# EAGLE design v8_8_controler (EAGLE 9.6.2)
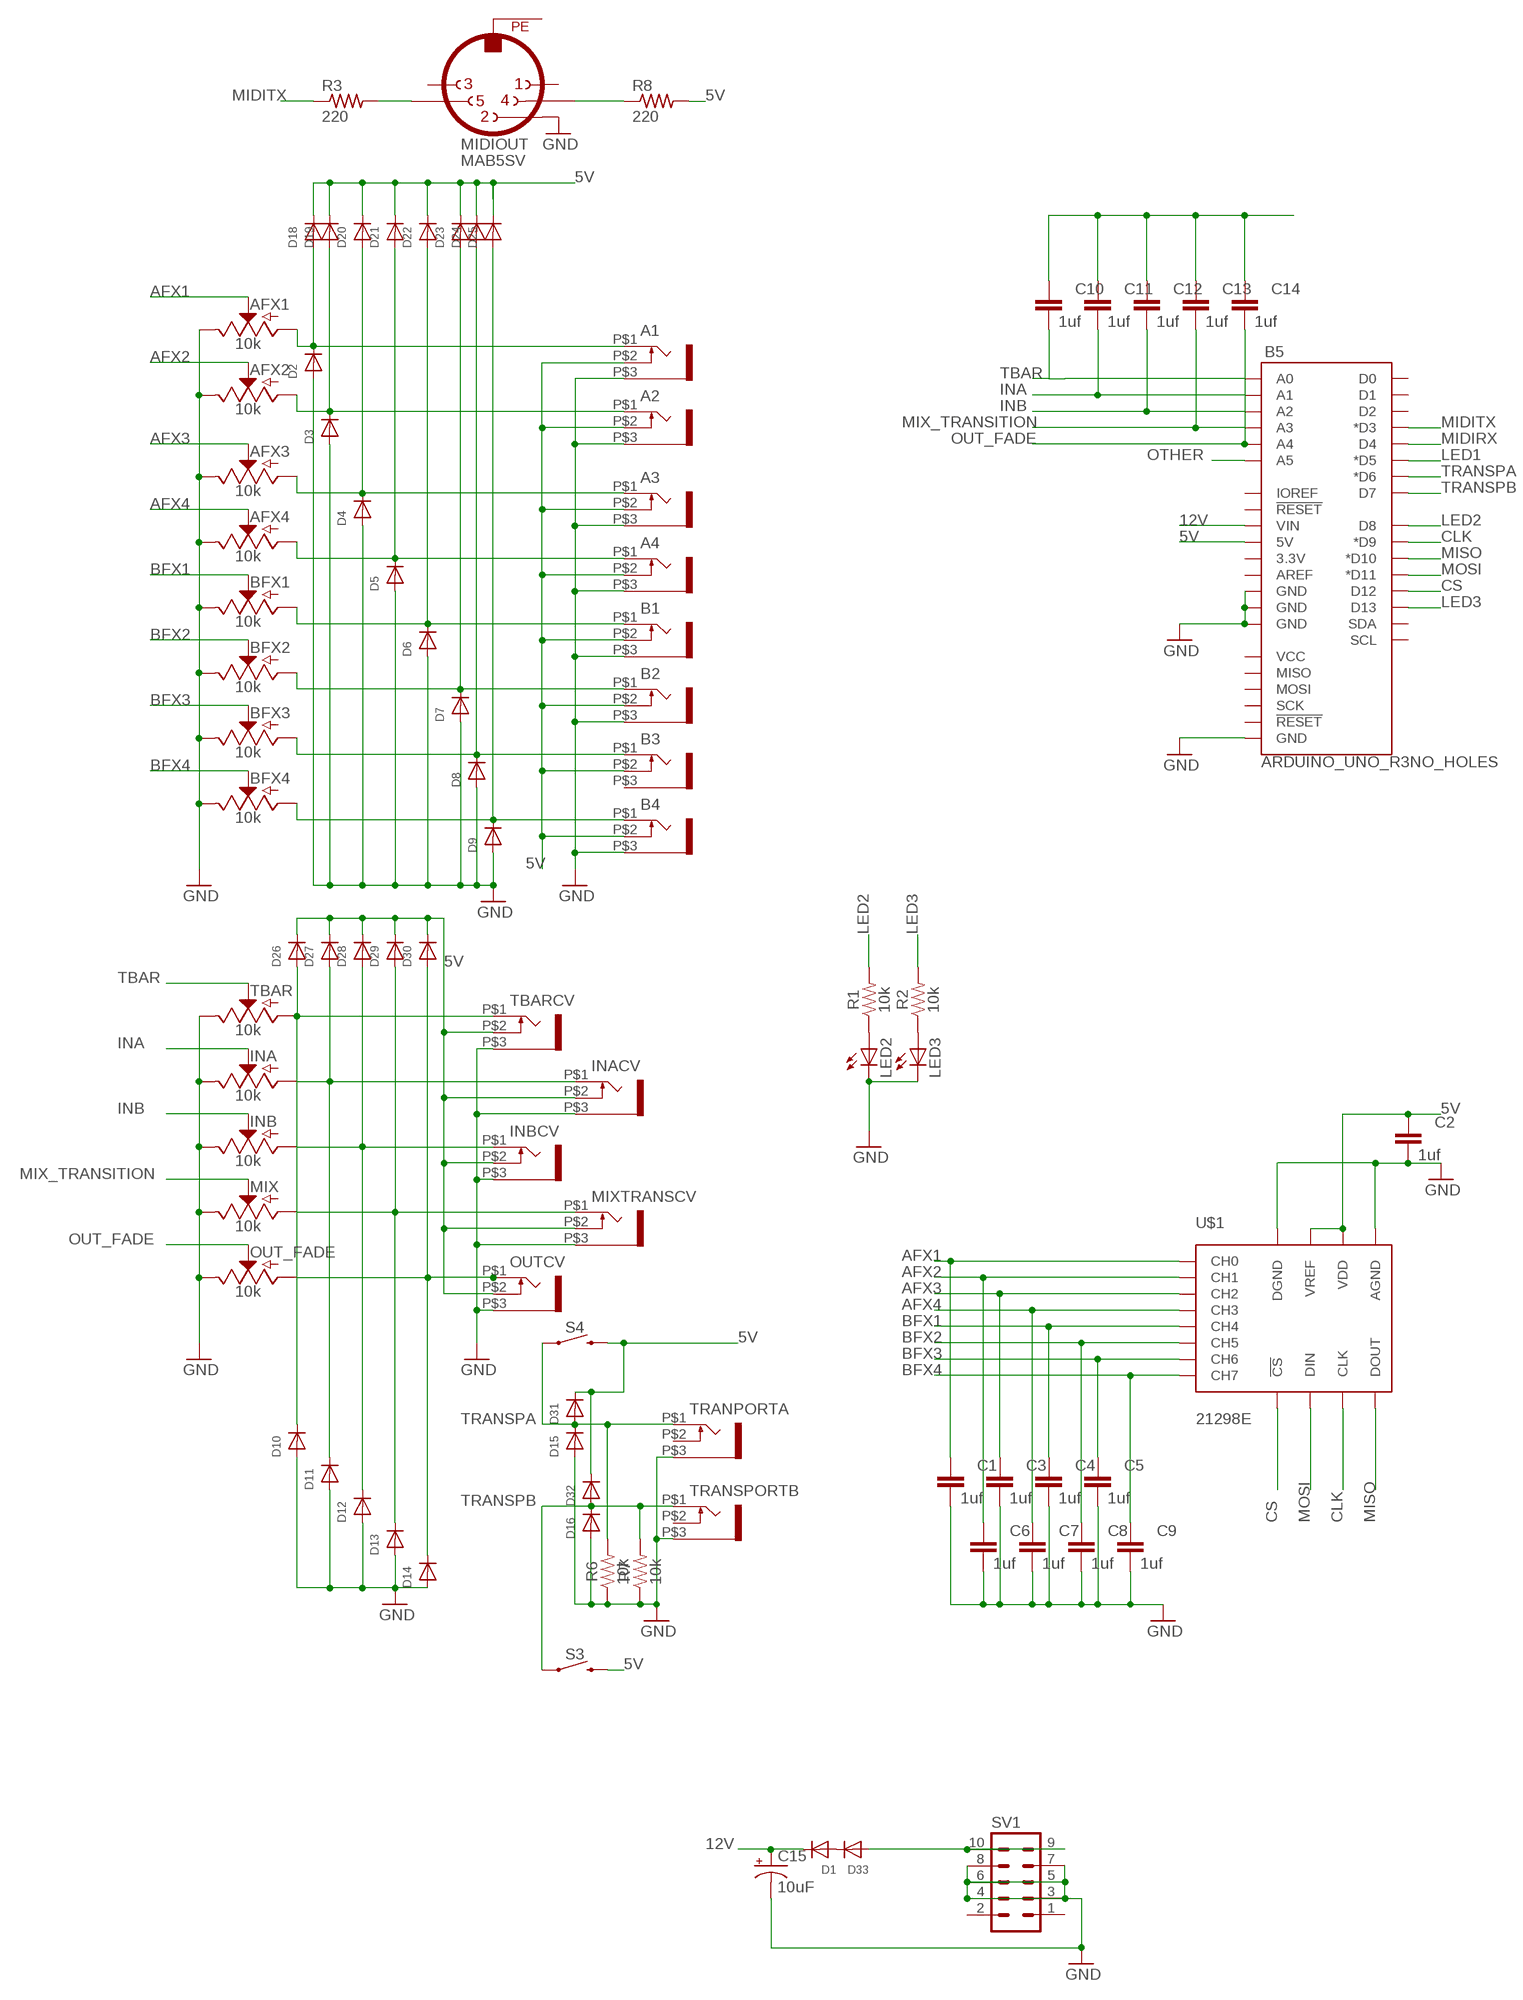
[diagram p0: schematic, sheet 1]

## Parts
A1  WQP-PJ301M-12_JACK  [WQP-PJ301M-12_JACK]
A2  WQP-PJ301M-12_JACK  [WQP-PJ301M-12_JACK]
A3  WQP-PJ301M-12_JACK  [WQP-PJ301M-12_JACK]
A4  WQP-PJ301M-12_JACK  [WQP-PJ301M-12_JACK]
AFX1  10k  POTENTIOMETER-PTH-9MM-1/20W-20%  [POT-PTH-ALPS]
AFX2  10k  POTENTIOMETER-PTH-9MM-1/20W-20%  [POT-PTH-ALPS]
AFX3  10k  POTENTIOMETER-PTH-9MM-1/20W-20%  [POT-PTH-ALPS]
AFX4  10k  POTENTIOMETER-PTH-9MM-1/20W-20%  [POT-PTH-ALPS]
B1  WQP-PJ301M-12_JACK  [WQP-PJ301M-12_JACK]
B2  WQP-PJ301M-12_JACK  [WQP-PJ301M-12_JACK]
B3  WQP-PJ301M-12_JACK  [WQP-PJ301M-12_JACK]
B4  WQP-PJ301M-12_JACK  [WQP-PJ301M-12_JACK]
B5  ARDUINO_UNO_R3NO_HOLES  [ARDUINO_R3_NO_HOLES]
BFX1  10k  POTENTIOMETER-PTH-9MM-1/20W-20%  [POT-PTH-ALPS]
BFX2  10k  POTENTIOMETER-PTH-9MM-1/20W-20%  [POT-PTH-ALPS]
BFX3  10k  POTENTIOMETER-PTH-9MM-1/20W-20%  [POT-PTH-ALPS]
BFX4  10k  POTENTIOMETER-PTH-9MM-1/20W-20%  [POT-PTH-ALPS]
C1  1uf  0.33UF/330NF-0805-50V-10%  [0805]
C2  1uf  0.33UF/330NF-0805-50V-10%  [0805]
C3  1uf  0.33UF/330NF-0805-50V-10%  [0805]
C4  1uf  0.33UF/330NF-0805-50V-10%  [0805]
C5  1uf  0.33UF/330NF-0805-50V-10%  [0805]
C6  1uf  0.33UF/330NF-0805-50V-10%  [0805]
C7  1uf  0.33UF/330NF-0805-50V-10%  [0805]
C8  1uf  0.33UF/330NF-0805-50V-10%  [0805]
C9  1uf  0.33UF/330NF-0805-50V-10%  [0805]
C10  1uf  0.33UF/330NF-0805-50V-10%  [0805]
C11  1uf  0.33UF/330NF-0805-50V-10%  [0805]
C12  1uf  0.33UF/330NF-0805-50V-10%  [0805]
C13  1uf  0.33UF/330NF-0805-50V-10%  [0805]
C14  1uf  0.33UF/330NF-0805-50V-10%  [0805]
C15  10uF  10UF-POLAR-EIA3528-20V-10%(TANT)  [EIA3528]
D1  DIODE_SOD-123FL  [SOD-123FL]
D2  DIODE_SOD-123FL  [SOD-123FL]
D3  DIODE_SOD-123FL  [SOD-123FL]
D4  DIODE_SOD-123FL  [SOD-123FL]
D5  DIODE_SOD-123FL  [SOD-123FL]
D6  DIODE_SOD-123FL  [SOD-123FL]
D7  DIODE_SOD-123FL  [SOD-123FL]
D8  DIODE_SOD-123FL  [SOD-123FL]
D9  DIODE_SOD-123FL  [SOD-123FL]
D10  DIODE_SOD-123FL  [SOD-123FL]
D11  DIODE_SOD-123FL  [SOD-123FL]
D12  DIODE_SOD-123FL  [SOD-123FL]
D13  DIODE_SOD-123FL  [SOD-123FL]
D14  DIODE_SOD-123FL  [SOD-123FL]
D15  DIODE_SOD-123FL  [SOD-123FL]
D16  DIODE_SOD-123FL  [SOD-123FL]
D18  DIODE_SOD-123FL  [SOD-123FL]
D19  DIODE_SOD-123FL  [SOD-123FL]
D20  DIODE_SOD-123FL  [SOD-123FL]
D21  DIODE_SOD-123FL  [SOD-123FL]
D22  DIODE_SOD-123FL  [SOD-123FL]
D23  DIODE_SOD-123FL  [SOD-123FL]
D24  DIODE_SOD-123FL  [SOD-123FL]
D25  DIODE_SOD-123FL  [SOD-123FL]
D26  DIODE_SOD-123FL  [SOD-123FL]
D27  DIODE_SOD-123FL  [SOD-123FL]
D28  DIODE_SOD-123FL  [SOD-123FL]
D29  DIODE_SOD-123FL  [SOD-123FL]
D30  DIODE_SOD-123FL  [SOD-123FL]
D31  DIODE_SOD-123FL  [SOD-123FL]
D32  DIODE_SOD-123FL  [SOD-123FL]
D33  DIODE_SOD-123FL  [SOD-123FL]
INA  10k  POTENTIOMETER-PTH-9MM-1/20W-20%  [POT-PTH-ALPS]
INACV  WQP-PJ301M-12_JACK  [WQP-PJ301M-12_JACK]
INB  10k  POTENTIOMETER-PTH-9MM-1/20W-20%  [POT-PTH-ALPS]
INBCV  WQP-PJ301M-12_JACK  [WQP-PJ301M-12_JACK]
LED2  LED3MM  [LED3MM]
LED3  LED3MM  [LED3MM]
MIDIOUT  MAB5SV  [MAB5SV]
MIX  10k  POTENTIOMETER-PTH-9MM-1/20W-20%  [POT-PTH-ALPS]
MIXTRANSCV  WQP-PJ301M-12_JACK  [WQP-PJ301M-12_JACK]
OUT_FADE  10k  POTENTIOMETER-PTH-9MM-1/20W-20%  [POT-PTH-ALPS]
OUTCV  WQP-PJ301M-12_JACK  [WQP-PJ301M-12_JACK]
R1  10k  0.75OHM-0805-1/4W-1%  [0805]
R2  10k  0.75OHM-0805-1/4W-1%  [0805]
R3  220  R-US_R0805  [R0805]
R6  10k  0.75OHM-0805-1/4W-1%  [0805]
R7  10k  0.75OHM-0805-1/4W-1%  [0805]
R8  220  R-US_R0805  [R0805]
S3  MOMENTARY-SWITCH-SPST-PTH-6.0MM  [TACTILE_SWITCH_PTH_6.0MM]
S4  MOMENTARY-SWITCH-SPST-PTH-6.0MM  [TACTILE_SWITCH_PTH_6.0MM]
SV1  MA05-2  [MA05-2]
TBAR  10k  POTENTIOMETER-PTH-9MM-1/20W-20%  [POT-PTH-ALPS]
TBARCV  WQP-PJ301M-12_JACK  [WQP-PJ301M-12_JACK]
TRANPORTA  WQP-PJ301M-12_JACK  [WQP-PJ301M-12_JACK]
TRANSPORTB  WQP-PJ301M-12_JACK  [WQP-PJ301M-12_JACK]
U$1  21298E  [PDIP16]

## Nets
5V: A1.P$2 A2.P$2 A3.P$2 A4.P$2 B1.P$2 B2.P$2 B3.P$2 B4.P$2 B5.5V C2.1 D18.C D19.C D20.C D21.C D22.C D23.C D24.C D25.C D26.C D27.C D28.C D29.C D30.C D31.C D32.C INACV.P$2 INBCV.P$2 MIXTRANSCV.P$2 OUTCV.P$2 R8.2 S3.3 S4.3 TBARCV.P$2 U$1.P$15(VREF) U$1.P$16(VDD)
12V: B5.VIN C15.A(+) D1.C
AFX1: AFX1.P$2(S) C1.1 U$1.P$1(CH0)
AFX2: AFX2.P$2(S) C6.1 U$1.P$2(CH1)
AFX3: AFX3.P$2(S) C3.1 U$1.P$3(CH2)
AFX4: AFX4.P$2(S) C7.1 U$1.P$4(CH3)
BFX1: BFX1.P$2(S) C4.1 U$1.P$5(CH4)
BFX2: BFX2.P$2(S) C8.1 U$1.P$6(CH5)
BFX3: BFX3.P$2(S) C5.1 U$1.P$7(CH6)
BFX4: BFX4.P$2(S) C9.1 U$1.P$8(CH7)
CLK: B5.D9(*D9) U$1.P$13(CLK)
CS: B5.D12 U$1.P$10(!CS)
GND: A1.P$3 A2.P$3 A3.P$3 A4.P$3 AFX1.P$1(E) AFX2.P$1(E) AFX3.P$1(E) AFX4.P$1(E) B1.P$3 B2.P$3 B4.P$3 B5.GND@1(GND) B5.GND@2(GND) B5.GND@3(GND) B5.GND@4(GND) BFX1.P$1(E) BFX2.P$1(E) BFX3.P$1(E) BFX4.P$1(E) C1.2 C2.2 C3.2 C4.2 C5.2 C6.2 C7.2 C8.2 C9.2 C15.C(-) D2.A D3.A D4.A D5.A D6.A D7.A D8.A D9.A D10.A D11.A D12.A D13.A D14.A D15.A D16.A INA.P$1(E) INACV.P$3 INB.P$1(E) INBCV.P$3 LED2.K(C) LED3.K(C) MIDIOUT.2 MIX.P$1(E) MIXTRANSCV.P$3 OUT_FADE.P$1(E) OUTCV.P$3 R6.1 R7.1 SV1.3 SV1.4 SV1.5 SV1.6 SV1.7 SV1.8 TBAR.P$1(E) TBARCV.P$3 TRANPORTA.P$3 TRANSPORTB.P$3 U$1.P$9(DGND) U$1.P$14(AGND)
INA: B5.A1 C11.2 INA.P$2(S)
INB: B5.A2 C12.2 INB.P$2(S)
LED1: B5.D5(*D5)
LED2: B5.D8 R1.2
LED3: B5.D13 R2.2
MIDIRX: B5.D4
MIDITX: B5.D3(*D3) R3.1
MISO: B5.D10(*D10) U$1.P$12(DOUT)
MIX_TRANSITION: B5.A3 C13.2 MIX.P$2(S)
MOSI: B5.D11(*D11) U$1.P$11(DIN)
N$1: A1.P$1 AFX1.P$3(A) D2.C D18.A
N$2: A2.P$1 AFX2.P$3(A) D3.C D19.A
N$3: A3.P$1 AFX3.P$3(A) D4.C D20.A
N$4: A4.P$1 AFX4.P$3(A) D5.C D21.A
N$5: B1.P$1 BFX1.P$3(A) D6.C D22.A
N$6: B2.P$1 BFX2.P$3(A) D7.C D23.A
N$7: B3.P$1 BFX3.P$3(A) D8.C D24.A
N$8: B4.P$1 BFX4.P$3(A) D9.C D25.A
N$9: MIDIOUT.4 R8.1
N$10: LED2.A R1.1
N$11: MIDIOUT.5 R3.2
N$12: LED3.A R2.1
N$13: D1.A D33.C
N$14: D10.C D26.A TBAR.P$3(A) TBARCV.P$1
N$15: D11.C D27.A INA.P$3(A) INACV.P$1
N$16: D12.C D28.A INB.P$3(A) INBCV.P$1
N$17: D13.C D29.A MIX.P$3(A) MIXTRANSCV.P$1
N$18: D14.C D30.A OUT_FADE.P$3(A) OUTCV.P$1
N$19: C10.1 C11.1 C12.1 C13.1 C14.1
N$20: D33.A SV1.9 SV1.10
OTHER: B5.A5
OUT_FADE: B5.A4 C14.2 OUT_FADE.P$2(S)
TBAR: B5.A0 C10.2 TBAR.P$2(S)
TRANSPA: B5.D6(*D6) D15.C D31.A R6.2 S4.1 TRANPORTA.P$1
TRANSPB: B5.D7 D16.C D32.A R7.2 S3.1 TRANSPORTB.P$1
Unconnected: B3.P$3 B5.3.3V B5.AREF B5.D0 B5.D1 B5.D2 B5.IOREF B5.MISO B5.MOSI B5.RESET@1(!RESET!) B5.RESET@2(!RESET!) B5.SCK B5.SCL B5.SDA B5.VCC MIDIOUT.1 MIDIOUT.3 SV1.1 SV1.2 TRANPORTA.P$2 TRANSPORTB.P$2

## Power pins joined to a net without a drawn wire
PE: MIDIOUT.PE

## Library data of the parts
A1-A4 B1-B4 INACV INBCV MIXTRANSCV OUTCV TBARCV TRANPORTA TRANSPORTB = thonkiconn:WQP-PJ301M-12_JACK; PANEL_DRILL_MM: 6.15; SPICEPREFIX: U
AFX1-AFX4 BFX1-BFX4 INA INB MIX OUT_FADE TBAR = SparkFun-Resistors:POTENTIOMETER: Potentiometer (Pot) Three-terminal potentiometers, with an adjustable wiper and two adjustable resistors. A pot can be used to create a configurable voltage divider, or as a variable resistor. Variants ALPS_POT and ALPS_POT_KIT - PTH, breadboard compatible, 9mm square pots Rotary Potentiometer - Linear (10k ohm) <https://www.sparkfun.com/products/9288> (COM-09288) The KIT variant exposes copper on only one side of the PTH pad, so the part can only be assembled on one side of the PCB. Useful for beginner soldering kits.; PROD_ID: RES-09177; SF_SKU: COM-09288
B5 = SparkFun-Boards:ARDUINO_UNO_R3: Arduino R3 Footprint with SPI header Arduino Uno R3 Compatible Footprint. Matches PCB size of the original board. SparkFun Products: SAMD21 Dev Breakout <https://www.sparkfun.com/products/13672> RedBoard <https://www.sparkfun.com/products/12757> R3 Stackable Headers <https://www.sparkfun.com/products/11417>
C1-C14 = SparkFun-Capacitors:0.33UF/330NF: 0.33µF/330nF ceramic capacitors A capacitor is a passive two-terminal electrical component used to store electrical energy temporarily in an electric field.; PROD_ID: CAP-08469; VALUE: 0.33µF
C15 = SparkFun-Capacitors:10UF-POLAR: 10.0µF polarized capacitors A capacitor is a passive two-terminal electrical component used to store electrical energy temporarily in an electric field.; PROD_ID: CAP-08063
D1-D16 D18-D33 = adafruit:DIODE: Diode SMADIODE - SMA Surface Mount Package 20V 1A Schottky Diode Digikey: 641-1014-6-ND DO-1N4148 - Through Hole Small Current Diode SOD-123 20V 1 A (.5mV Vf) Schottky Diode - Digikey: MBRX120TPMSCT-ND SOD-323 10V 570mA (.38mV Vf, 3ns) Schottky Diode - Digikey: ZLLS410CT-ND SOD-523 30V 30mA Schottky Diode (RB751S-40TE61) - Digikey: RB751S-40TE61CT-ND SOT23-R/W - SOT23 Package (R = Solder Paste/Reflow Ovens, W = Hand-Soldering) BAT54Film 40V 300mA - Digikey: 497-7162-1-ND
LED2 LED3 = adafruit:LED: LED OSRAM: - CHIPLED LG R971, LG N971, LY N971, LG Q971, LY Q971, LO R971, LY R971 LH N974, LH R974 LS Q976, LO Q976, LY Q976 LO Q996 - Hyper CHIPLED LW Q18S LB Q993, LB Q99A, LB R99A - SideLED LS A670, LO A670, LY A670, LG A670, LP A670 LB A673, LV A673, LT A673, LW A673 LH A674 LY A675 LS A676, LA A676, LO A676, LY A676, LW A676 LS A679, LY A679, LG A679 - Hyper Micro SIDELED® LS Y876, LA Y876, LO Y876, LY Y876 LT Y87S - SmartLED LW L88C, LW L88S LB L89C, LB L89S, LG L890 LS L89K, LO L89K, LY L89K LS L896, LA L896, LO L896, LY L896 - TOPLED LS T670, LO T670, LY T670, LG T670, LP T670 LSG T670, LSP T670, LSY T670, LOP T670, LYG T670 LG T671, LOG T671, LSG T671 LB T673, LV T673, LT T673, LW T673 LH T674 LS T676, LA T676, LO T676, LY T676, LB T676, LH T676, LSB T676, LW T676 LB T67C, LV T67C, LT T67C, LS T67K, LO T67K, LY T67K, LW E67C LS E67B, LA E67B, LO E67B, LY E67B, LB E67C, LV E67C, LT E67C LW T67C LS T679, LY T679, LG T679 LS T770, LO T770, LY T770, LG T770, LP T770 LB T773, LV T773, LT T773, LW T773 LH T774 LS E675, LA E675, LY E675, LS T675 LS T776, LA T776, LO T776, LY T776, LB T776 LHGB T686 LT T68C, LB T68C - Hyper Mini TOPLED® LB M676 - Mini TOPLED Santana® LG M470 LS M47K, LO M47K, LY M47K Source: http://www.osram.convergy.de/
MIDIOUT = con-hirschmann:MAB5SV: Female CONNECTOR 5 pins 90 deg. with shield, vertical (DIN41524); OC_FARNELL: unknown; OC_NEWARK: unknown
R1 R2 R6 R7 = SparkFun-Resistors:0.75OHM: 0.75Ω resistor A resistor is a passive two-terminal electrical component that implements electrical resistance as a circuit element. Resistors act to reduce current flow, and, at the same time, act to lower voltage levels within circuits. - Wikipedia; PROD_ID: RES-08474; VALUE: 0.75
R3 R8 = adafruit:R-US_: RESISTOR, American symbol
S3 S4 = SparkFun-Switches:MOMENTARY-SWITCH-SPST: Momentary Switch (Pushbutton) - SPST Normally-open (NO) SPST momentary switches (buttons, pushbuttons). Variants PTH-12MM - 12mm square, through-hole Momentary Pushbutton Switch - 12mm Square <https://www.sparkfun.com/products/9190> (COM-09190) PTH-6.0MM, PTH-6.0MM-KIT - 6.0mm square, through-hole Mini Pushbutton Switch <https://www.sparkfun.com/products/97> (COM-00097) KIT package intended for soldering kit's - only one side of pads' copper is exposed. PTH-RIGHT-ANGLE-KIT - Right-angle, through-hole Right Angle Tactile Button <https://www.sparkfun.com/products/10791> - Used on SparkFun BigTime Watch Kit <https://www.sparkfun.com/products/11734> SMD-12MM - 12mm square, surface-mount Tactile Button - SMD (12mm) <https://www.sparkfun.com/products/12993> (COM-12993) Used on SparkFun PicoBoard <https://www.sparkfun.com/products/11888> SMD-4.5MM - 4.5mm Square Trackball Switch Used on SparkFun Blackberry Trackballer Breakout <https://www.sparkfun.com/products/13169> SMD-4.6MMX2.8MM - 4.60mm x 2.80mm, surface mount Used on SparkFun SAMD21 Mini Breakout <https://www.sparkfun.com/products/13664> SMD-5.2MM, SMD-5.2-REDUNDANT - 5.2mm square, surface-mount Mini Pushbutton Switch - SMD <https://www.sparkfun.com/products/8720> (COM-08720) Used on Arduino Pro Mini <https://www.sparkfun.com/products/11114> REDUNDANT package connects both switch circuits together SMD-6.0X3.5MM - 6.0 x 3.5mm, surface mount Momentary Reset Switch SMD <https://www.sparkfun.com/products/8229> (COM-08229) SMD-6.2MM-TALL - 6.2mm square, surface mount Tactile Button - SMD (6mm) <https://www.sparkfun.com/products/12992> Used on SparkFun Digital Sandbox <https://www.sparkfun.com/products/12651> SMD-RIGHT-ANGLE - Right-angle, surface mount Used on SparkFun Block for Intel® Edison - Arduino <https://www.sparkfun.com/products/13036>; PROD_ID: SWCH-08441; SF_SKU: COM-00097
SV1 = con-lstb:MA05-2: PIN HEADER; OC_FARNELL: unknown; OC_NEWARK: unknown
U$1 = MCP3208:21298E

## Board
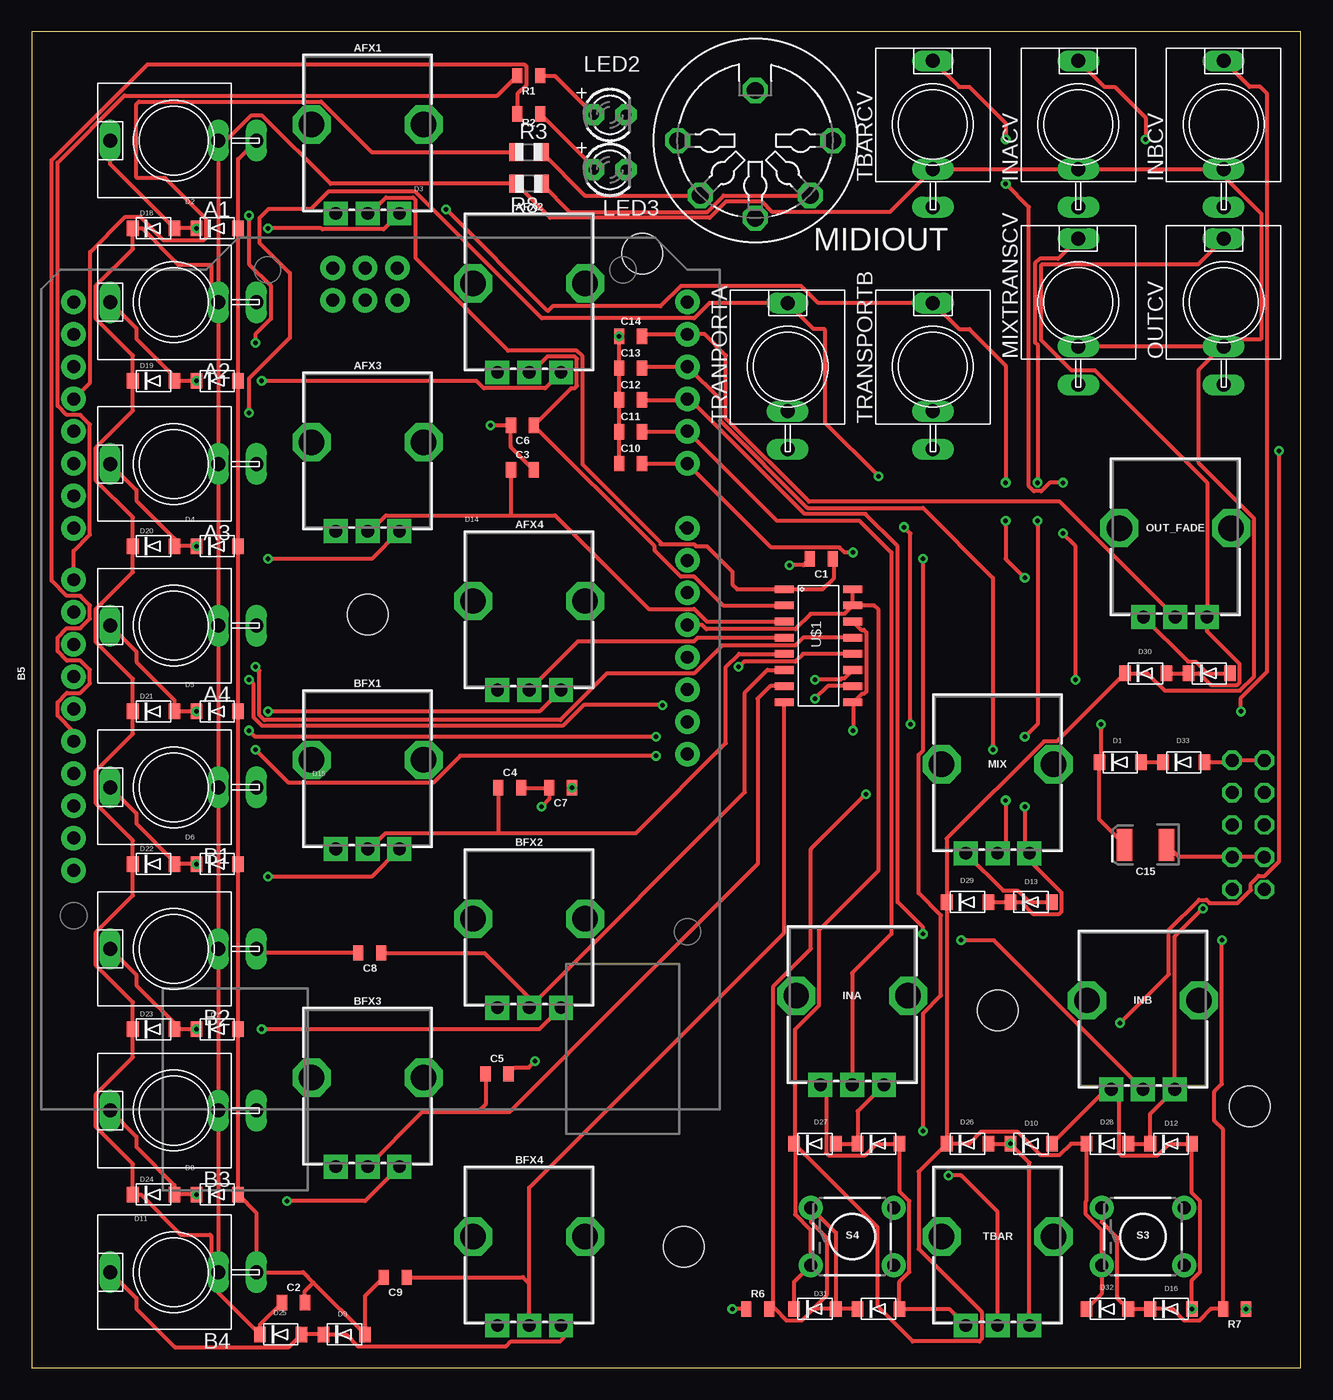
[diagram p1: board, top side]
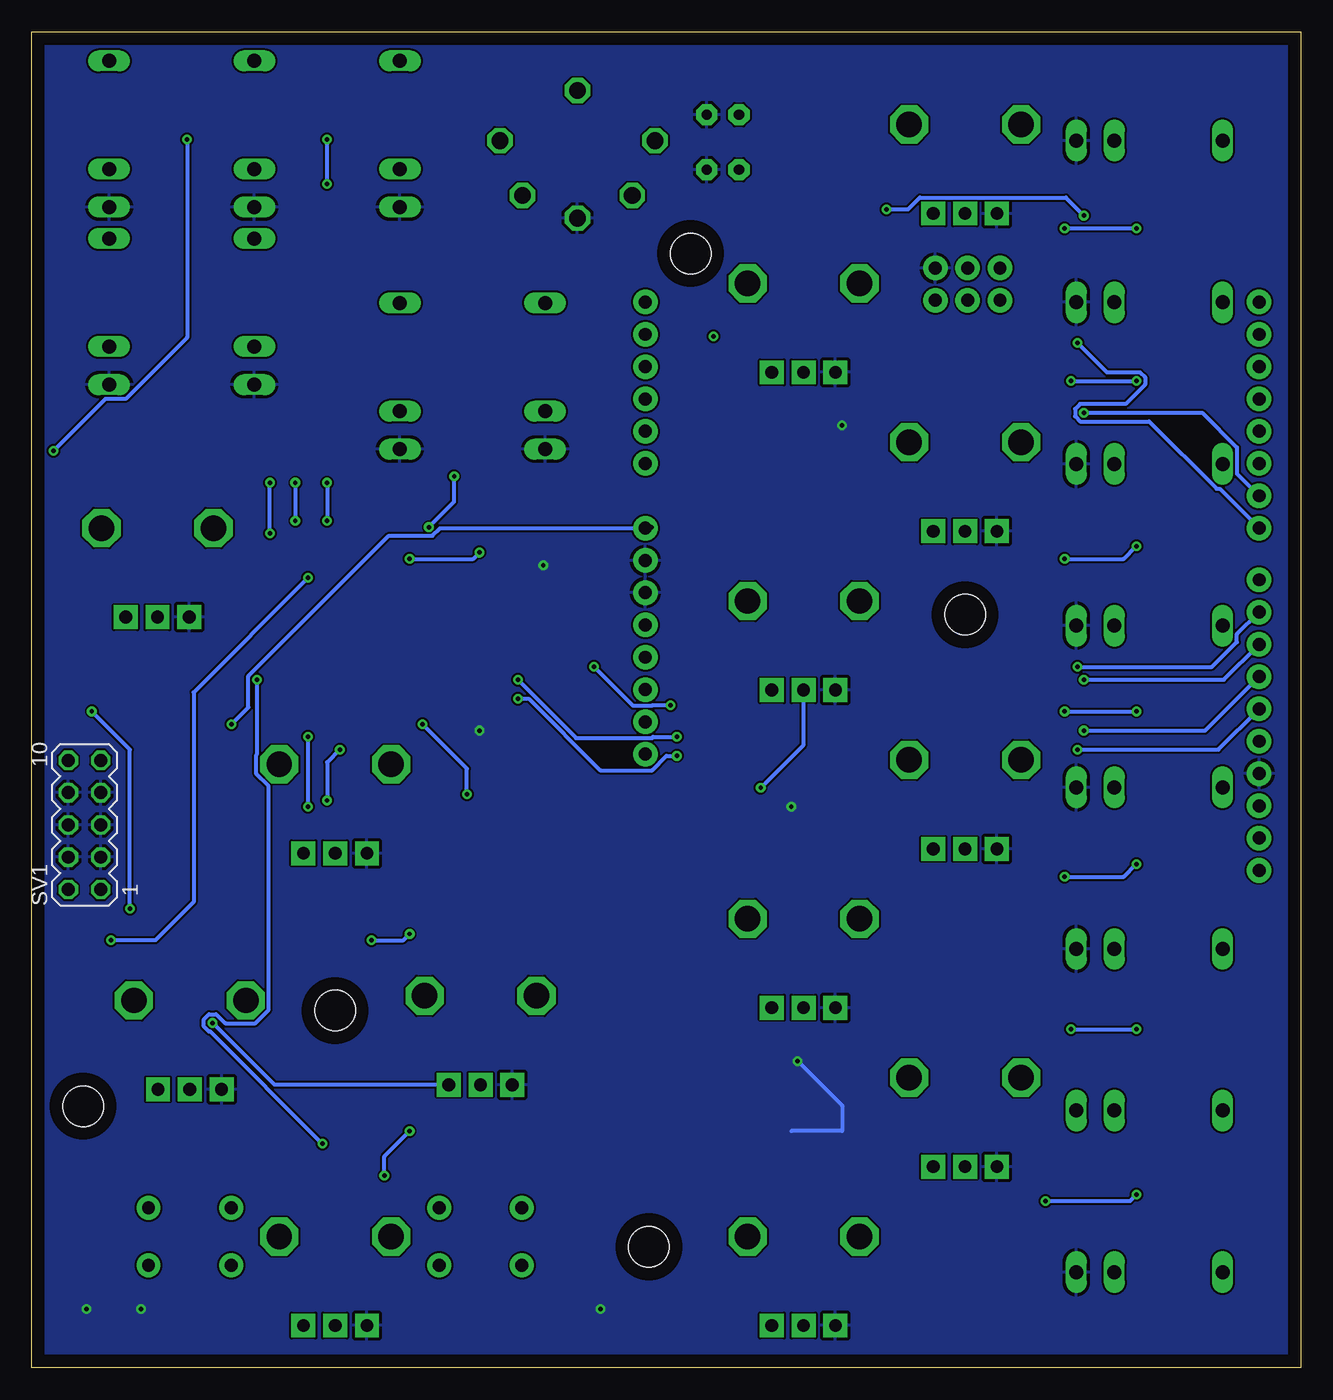
[diagram p2: board, bottom side, seen from below]

Size 99.79 x 105.08 mm. Coordinates in mm from the lower left corner, seen from the top.
Outline: 0,0 99.79,0 99.79,105.08 0,105.08 0,0
Copper layers (1*16): Top 0.035mm / dielectric 1.5mm / Bottom 0.035mm
Design rules "default": minimum track width 6mil, minimum drill 0.35mm, track to track 6mil, track to pad 6mil, pad to pad 6mil, via to via 6mil, smd to smd 6mil, copper to edge 40mil, drill to drill 6mil, minimum pad ring 10mil, minimum via ring 8mil, stop-mask expansion 4mil, vias tented up to drill 0mil, thermal gap 10mil
Holes 3.2 mm at 51.27,9.51 48,87.63 26.41,59.23 75.94,28.1 95.75,20.57

### Footprints (pad centres in the part's own frame; a part is rotated, then mirrored left to right if it is on the bottom)
WQP-PJ301M-12_JACK = drill 1.1 long: P$1 0,5; P$2 0,-3.5; P$3 0,-6.5
POT-PTH-ALPS = drill 1 pad 1.88 square: P$1 7,-2.5; P$2 7,0; P$3 7,2.5 | drill 2 octagon: P$4 0,-4.4; P$5 0,4.4
ARDUINO_R3_NO_HOLES = drill 1.016 pad 1.93: 3.3V 1.27,-24.13; 5V 3.81,-24.13; A0 16.51,-24.13; A1 19.05,-24.13; A2 21.59,-24.13; A3 24.13,-24.13; A4 26.67,-24.13; A5 29.21,-24.13; AREF -10.414,24.13; D0 29.21,24.13; D1 26.67,24.13; D2 24.13,24.13; D3 21.59,24.13; D4 19.05,24.13; D5 16.51,24.13; D6 13.97,24.13; D7 11.43,24.13; D8 7.366,24.13; D9 4.826,24.13; D10 2.286,24.13; D11 -0.254,24.13; D12 -2.794,24.13; D13 -5.334,24.13; GND@1 6.35,-24.13; GND@2 8.89,-24.13; GND@3 -7.874,24.13; GND@4 31.89,-1.32; IOREF -3.81,-24.13; MISO 29.35,3.76; MOSI 31.89,1.22; NC -6.35,-24.13; RESET@1 -1.27,-24.13; RESET@2 29.35,-1.32; SCK 29.35,1.22; SCL -15.494,24.13; SDA -12.954,24.13; VCC 31.89,3.76; VIN 11.43,-24.13
0805 = smd 0.8 x 1.2: 1 -0.9,0; 2 0.9,0
EIA3528 = smd 1.2 x 2.5: A 1.65,0; C -1.65,0
SOD-123FL = smd 0.91 x 1.22: A 1.637,0; C -1.637,0
LED3MM = drill 0.813 pad 1.676 octagon: A -1.27,0; K 1.27,0
MAB5SV = drill 1.321 octagon: 1 6.096,0; 2 0,-6.096; 3 -6.096,0; 4 4.318,-4.318; 5 -4.318,-4.318; PE 0,3.937
R0805 = smd 1.1 x 1.4: 1 -1,0; 2 1,0
TACTILE_SWITCH_PTH_6.0MM = drill 1.016 pad 1.88: 1 -3.251,2.261; 2 3.251,2.261; 3 -3.251,-2.261; 4 3.251,-2.261
MA05-2 = drill 1.016 octagon: 1 -5.08,-1.27; 2 -5.08,1.27; 3 -2.54,-1.27; 4 -2.54,1.27; 5 0,-1.27; 6 0,1.27; 7 2.54,-1.27; 8 2.54,1.27; 9 5.08,-1.27; 10 5.08,1.27
PDIP16 = smd 0.6 x 1.5: P$1 0,0; P$2 1.27,0; P$3 2.54,0; P$4 3.81,0; P$5 5.08,0; P$6 6.35,0; P$7 7.62,0; P$8 8.89,0; P$9 8.89,5.4; P$10 7.62,5.4; P$11 6.35,5.4; P$12 5.08,5.4; P$13 3.81,5.4; P$14 2.54,5.4; P$15 1.27,5.4; P$16 0,5.4

### Placement (x,y rotation side)
A1  11.17,96.52 90 top
A2  11.17,83.8 90 top
A3  11.17,71.09 90 top
A4  11.17,58.37 90 top
AFX1  26.41,97.79 270 top
AFX2  39.11,85.29 270 top
AFX3  26.41,72.8 270 top
AFX4  39.11,60.3 270 top
B1  11.17,45.66 90 top
B2  11.17,32.94 90 top
B3  11.17,20.23 90 top
B4  11.17,7.51 90 top
B5  27.42,54.61 90 top
BFX1  26.41,47.81 270 top
BFX2  39.11,35.31 270 top
BFX3  26.41,22.82 270 top
BFX4  39.11,10.32 270 top
C1  62.08,63.62 180 top
C2  20.58,5.12 0 top
C3  38.58,70.62 0 top
C4  37.58,45.62 0 top
C5  36.58,23.12 0 top
C6  38.58,74.12 180 top
C7  41.58,45.62 180 top
C8  26.58,32.62 180 top
C9  28.58,7.12 180 top
C10  47.08,71.12 0 top
C11  47.08,73.62 0 top
C12  47.08,76.12 0 top
C13  47.08,78.62 0 top
C14  47.08,81.12 0 top
C15  87.58,41.12 180 top
D1  85.58,47.62 0 top
D2  14.58,89.62 0 top
D3  14.58,77.62 0 top
D4  14.58,64.62 0 top
D5  14.58,51.62 0 top
D6  14.58,39.62 0 top
D7  14.58,26.62 0 top
D8  14.58,13.62 0 top
D9  24.58,2.62 0 top
D10  78.58,17.62 0 top
D11  66.58,17.62 0 top
D12  89.58,17.62 0 top
D13  78.58,36.62 0 top
D14  92.58,54.62 0 top
D15  66.58,4.62 0 top
D16  89.58,4.62 0 top
D18  9.58,89.62 0 top
D19  9.58,77.62 0 top
D20  9.58,64.62 0 top
D21  9.58,51.62 0 top
D22  9.58,39.62 0 top
D23  9.58,26.62 0 top
D24  9.58,13.62 0 top
D25  19.58,2.62 0 top
D26  73.58,17.62 0 top
D27  61.58,17.62 0 top
D28  84.58,17.62 0 top
D29  73.58,36.62 0 top
D30  87.58,54.62 0 top
D31  61.58,4.62 0 top
D32  84.58,4.62 0 top
D33  90.58,47.62 0 top
INA  64.51,29.25 270 top
INACV  82.29,97.79 0 top
INB  87.37,28.89 270 top
INBCV  93.72,97.79 0 top
LED2  45.46,98.55 0 top
LED3  45.46,94.23 0 top
MIDIOUT  56.89,96.52 0 top
MIX  75.94,47.47 270 top
MIXTRANSCV  82.29,83.82 0 top
OUT_FADE  89.91,66.04 270 top
OUTCV  93.72,83.82 0 top
R1  39.08,101.62 180 top
R2  39.08,98.62 180 top
R3  39.08,95.62 0 top
R6  57.08,4.62 0 top
R7  94.58,4.62 180 top
R8  39.08,93.12 180 top
S3  87.37,10.32 0 top
S4  64.51,10.32 0 top
SV1  95.64,42.7 90 bottom
TBAR  75.94,10.32 270 top
TBARCV  70.86,97.79 0 top
TRANPORTA  59.43,78.74 0 top
TRANSPORTB  70.86,78.74 0 top
U$1  59.16,61.23 270 top

### Tracks (layer width: path | path; a pad name or v marks a point on that pad's centre or on a via)
5V
  Top 0.305: 14.67,83.62 A2.P$2 A1.P$2 15.24,96.52 17.2,98.48 18.14,98.48 23.49,93.12 R8.2 40.75,90.45 53.3,90.45 54.57,91.72 57.43,91.72 58.24,90.91 67.48,90.91 TBARCV.P$2 INACV.P$2 INBCV.P$2 93.72,93.71 96.67,90.76 96.67,80.96 96.58,80.87 94.27,80.87 OUTCV.P$2 93.58,80.32 | 14.67,83.62 A3.P$2 A4.P$2 B1.P$2 B2.P$2 B3.P$2 B4.P$2 | 14.67,83.62 14.12,84.17 14.12,86.67 14.03,86.76 11.53,86.76 8.67,89.62 D18.C 7.94,88 5.04,85.1 5.04,82.51 7.94,79.61 D19.C 7.94,75.28 5.04,72.38 5.04,69.8 7.94,66.89 D20.C 7.94,62.57 5.04,59.67 5.04,57.08 7.94,54.18 D21.C 7.94,49.85 5.04,46.95 5.04,44.36 7.94,41.46 D22.C 7.94,37.14 5.04,34.23 5.04,31.65 7.94,28.75 D23.C 7.94,24.42 5.04,21.52 5.04,18.93 7.94,16.03 D24.C 8.56,13.62 11.72,10.46 14.03,10.46 14.12,10.37 14.12,8.06 B4.P$2 | B4.P$2 14.67,5.89 D25.C 17.94,3.38 C2.1 | D32.C 84.12,5.8 S3.3 84.12,10.82 82.87,12.06 82.87,13.1 82.94,13.16 D28.C 81.71,17.62 80.8,16.71 79.35,16.71 77.52,18.54 74.63,18.54 73.72,17.62 D26.C | D31.C 59.94,6.74 S4.3 61.26,10.82 60.01,12.06 60.01,17.55 | D26.C D29.C 71.94,41.62 79.59,49.27 80.59,49.27 D30.C 87.72,54.62 89.09,53.25 94.99,53.25 96.11,54.38 96.11,66.79 91.76,71.14 91.76,78.51 93.58,80.32 | D27.C 60.01,17.55 | 93.58,80.32 MIXTRANSCV.P$2 | D26.C 69.73,15.41 69.73,9.33 74.68,4.39 74.68,2.25 74.5,2.08 69.26,2.08 66.52,4.83 66.52,11.05 60.01,17.55 | 60.01,17.55 60.01,26.6 61.91,28.5 61.91,34.45 66.58,39.12 66.58,59.62 66.24,59.96 U$1.P$15 | U$1.P$15 U$1.P$16 | U$1.P$15 63.89,59.29 61.24,59.29 60.03,58.09 53.04,58.09 52.7,58.42 B5.5V
12V  (via drill 0.35)
  Top 0.305: C15.A 83.94,43.11 D1.C 84.08,47.76 v84.08,50.62 | B5.VIN 51.47,66.12 v51.08,66.12
  Bottom 0.305: B5.VIN 67.69,66.04 68.3,65.44 71.73,65.44 82.76,54.4 82.76,51.94 v84.08,50.62
AFX1
  Top 0.305: AFX1.P$2 26.6,90.79 27.84,92.04 29.97,92.04 30.15,91.86 30.15,87.3 37.45,80 42.86,80 43.31,79.55 43.31,71.04 49.58,64.77 | 49.43,64.77 49.58,64.77 | 49.58,64.77 52.08,64.77 52.23,64.62 53.08,64.62 55.08,62.62 55.08,61.62 55.47,61.23 U$1.P$1 62.19,61.23 63.08,62.12 63.08,63.52 C1.1
AFX2
  Top 0.305: U$1.P$2 54.35,59.96 52.08,62.23 51.03,62.23 48.97,64.29 48.97,64.63 C6.1 42.41,77.05 42.67,77.05 42.85,77.23 42.85,79.36 42.67,79.54 40.54,79.54 39.3,78.29 AFX2.P$2
AFX3
  Top 0.305: AFX3.P$2 26.6,65.8 27.84,67.04 37.58,67.04 | 37.58,67.04 41.16,67.04 48.51,59.69 52.08,59.69 53.08,58.69 U$1.P$3 | C3.1 37.68,67.14 37.58,67.04
AFX4  (via drill 0.35)
  Top 0.305: U$1.P$4 52.35,57.42 52.08,57.15 42.96,57.15 AFX4.P$2
  Bottom 0.305: C7.1 39.11,48.99 AFX4.P$2
  other vias: 42.48,45.62
BFX1
  Top 0.305: BFX1.P$2 26.6,40.81 27.84,42.05 36.58,42.05 | 36.58,42.05 47.51,42.05 54.58,49.12 54.58,55.12 55.61,56.15 U$1.P$5 | C4.1 36.68,42.15 36.58,42.05
BFX2
  Top 0.305: BFX2.P$2 39.5,28.7 | 39.5,28.7 56.08,45.28 56.08,53.12 57.84,54.88 U$1.P$6 | C8.1 35.58,32.62 39.5,28.7
BFX3
  Top 0.305: BFX3.P$2 30.71,20.12 35.08,20.12 | 35.08,20.12 37.58,20.12 57.08,39.62 57.08,52.62 58.08,53.62 58.09,53.61 U$1.P$7 | C5.1 35.68,20.72 35.08,20.12
BFX4
  Top 0.305: BFX4.P$2 39.11,6.62 | 39.11,6.62 39.11,14.15 59.16,34.2 U$1.P$8 | C9.1 38.61,7.12 39.11,6.62
CLK  (via drill 0.35)
  Top 0.305: U$1.P$13 60.64,57.42 60.03,56.81 54.29,56.81 52.08,54.61 45.23,54.61 41.55,50.94 18.29,50.94 17.89,51.34 17.89,54.8 v17.58,55.12
  Bottom 0.305: B5.D9 5.04,57.69 5.04,57.08 7,55.12 v17.58,55.12
CS  (via drill 0.35)
  Top 0.305: U$1.P$10 62.57,53.61 v61.58,52.62 | v49.08,48.12 33.67,48.12 31.56,46 20.2,46 v17.58,48.62
  Bottom 0.305: v61.58,52.62 60.73,52.62 55.1,46.99 51.03,46.99 49.9,48.12 v49.08,48.12 | v17.58,48.62 6.49,48.62 B5.D12
GND  (via drill 0.35)
  Top 0.305: 22.15,6.69 21.32,7.51 B4.P$3 17.67,12.17 D8.A D7.A D6.A D5.A D4.A D3.A D2.A 16.21,95.07 A1.P$3 | 22.15,6.69 D9.A 26.21,5.66 C9.2 | D16.A 91.22,6.9 91.86,7.54 91.86,13.1 91.22,13.74 D12.A 89.44,17.62 88.52,16.71 85.63,16.71 85.46,16.88 85.46,21.31 INB.P$1 84.49,21.89 D10.A | INA.P$1 62.46,21.8 62.46,16.88 62.63,16.71 65.52,16.71 66.44,17.62 D11.A 68.22,13.88 69,13.1 69,7.54 68.22,6.76 D15.A 72.14,4.62 TBAR.P$1 73.63,3.32 | MIX.P$1 76.37,37.53 77.52,37.53 78.44,36.62 D13.A | OUT_FADE.P$1 90.91,55.53 91.52,55.53 92.44,54.62 D14.A | 64.15,58.69 U$1.P$14 65.22,58.02 65.43,58.02 65.61,57.85 65.61,53.18 65.43,53 65.26,53 64.58,52.32 | U$1.P$9 64.58,52.32 | 64.58,52.32 v64.58,50.12 | C4.2 C7.2 40.68,44.72 v40.08,44.12 | C2.2 21.48,6.02 22.15,6.69 | C3.2 37.68,72.42 C6.2 v36.08,74.12 | C5.2 37.98,23.62 39.08,23.62 v39.58,24.12 | C8.2 17.99,32.62 B2.P$3 | SV1.4 SV1.3 90.19,40.16 C15.C | C1.2 60.68,63.12 v59.58,63.12 | R6.1 v55.08,4.62
  Bottom 0.305: R7.1 95.58,4.62 | D16.A 91.08,4.62 | v39.58,24.12 36.08,20.62 36.08,18.62 40.08,18.62
  other vias: 95.48,4.62 91.22,4.62
  pour Bottom: -9.88,112.76 102.88,112.76 102.88,-6.63 5.61,-13.49 -9.88,2
INA
  Top 0.305: INA.P$2 64.51,31.05 67.58,34.12 67.58,64.12 65.08,66.62 58.59,66.62 B5.A1 51.51,73.62 C11.2
INB  (via drill 0.35)
  Top 0.305: INB.P$2 75.64,33.62 v73.08,33.62 | v70.08,34.12 70.08,34.62 68.08,36.62 68.08,64.62 65.53,67.16 60.79,67.16 51.75,76.2 51.58,76.2 | 51.58,76.2 B5.A2 | C12.2 51.5,76.12 51.58,76.2
  Bottom 0.305: v73.08,33.62 70.58,33.62 v70.08,34.12
LED2
  Top 0.305: B5.D8 3.29,64.24 4.56,65.51 4.56,74.19 3.82,74.93 2.77,74.93 2.02,75.67 2.02,94.8 7.28,100.05 36.61,100.05 R1.2
LED3
  Top 0.305: B5.D13 3.29,50.02 2.02,51.29 2.02,52.34 2.77,53.09 3.82,53.09 4.56,53.83 4.56,54.88 3.82,55.63 2.77,55.63 2.02,56.37 2.02,57.42 2.77,58.17 3.82,58.17 4.56,58.91 4.56,59.96 3.82,60.71 2.77,60.71 1.57,61.91 1.57,94.99 9.1,102.53 38.7,102.53 38.88,102.35 38.88,100.89 38.18,100.19 R2.2
MIDITX
  Top 0.305: B5.D3 4.58,77.49 4.58,87.76 7.36,90.54 8.52,90.54 10.35,88.7 13.52,88.7 13.7,88.88 13.7,90.36 10.49,93.57 8.3,93.57 8.22,93.66 8.22,99.38 8.43,99.59 22.76,99.59 26.73,95.62 R3.1
MISO  (via drill 0.35)
  Top 0.305: U$1.P$12 60.64,56.15 60.03,55.54 56,55.54 v55.58,55.12 | v49.58,52.12 43.38,52.12 41.74,50.48 18.11,50.48 17.44,51.15 17.44,53.76 v17.08,54.12
  Bottom 0.305: v49.58,52.12 50.98,52.12 51.03,52.07 52.53,52.07 v55.58,55.12 | v17.08,54.12 6.07,54.12 B5.D10
MIX_TRANSITION  (via drill 0.35)
  Top 0.305: v75.58,48.62 75.58,62.12 70.08,67.62 60.98,67.62 54.12,74.48 54.12,76.17 B5.A3 48.1,78.74 C13.2 | v76.58,44.62 76.58,41.11 MIX.P$2
  Bottom 0.305: v75.58,48.62 76.58,47.62 v76.58,44.62
MOSI  (via drill 0.35)
  Top 0.305: U$1.P$11 63.89,54.21 63.68,54.21 63.59,54.12 v61.58,54.12 | v49.08,49.62 17.58,49.62 v17.08,50.12
  Bottom 0.305: v49.08,49.62 50.94,49.62 51.03,49.53 56.99,49.53 v61.58,54.12 | v17.08,50.12 7.53,50.12 B5.D11
N$1  (via drill 0.35)
  Top 0.305: D2.C D18.A 6.17,94.67 A1.P$1 | v18.58,89.62 22.77,89.62 22.84,89.55 27.66,89.55 AFX1.P$3
  Bottom 0.305: v18.58,89.62 D2.C
  other vias: 12.94,89.62
N$2  (via drill 0.35)
  Top 0.305: D3.C D19.A 11.21,77.94 8.22,80.94 8.22,81.76 A2.P$1 | v18.08,77.62 34.97,77.62 35.54,77.05 40.36,77.05 AFX2.P$3
  Bottom 0.305: v18.08,77.62 D3.C
  other vias: 12.94,77.62
N$3  (via drill 0.35)
  Top 0.305: D4.C D20.A 11.21,65.23 8.22,68.23 8.22,69.04 A3.P$1 | AFX3.P$3 26.73,63.62 v18.58,63.62
  Bottom 0.305: v18.58,63.62 13.94,63.62 D4.C
  other vias: 12.94,64.62
N$4  (via drill 0.35)
  Top 0.305: D5.C D21.A 11.21,52.51 8.22,55.51 8.22,56.32 A4.P$1 | AFX4.P$3 39.93,51.62 v18.58,51.62
  Bottom 0.305: v18.58,51.62 D5.C
  other vias: 12.94,51.62
N$5  (via drill 0.35)
  Top 0.305: D6.C D22.A 11.21,39.79 8.22,42.79 8.22,43.61 B1.P$1 | BFX1.P$3 26.72,38.62 v18.58,38.62
  Bottom 0.305: v18.58,38.62 13.94,38.62 D6.C
  other vias: 12.94,39.62
N$6  (via drill 0.35)
  Top 0.305: D7.C 11.58,26.62 | 11.58,26.62 D23.A | B2.P$1 8.22,30.89 8.22,30.08 11.58,26.72 11.58,26.62 | BFX2.P$3 39.92,26.62 v18.08,26.62
  Bottom 0.305: v18.08,26.62 D7.C
  other vias: 12.94,26.62
N$7  (via drill 0.35)
  Top 0.305: D8.C D24.A 11.21,14.36 8.22,17.36 8.22,18.18 B3.P$1 | BFX3.P$3 26.21,13.12 v20.08,13.12
  Bottom 0.305: v20.08,13.12 13.44,13.12 D8.C
  other vias: 12.94,13.62
N$8
  Top 0.305: B4.P$1 8.22,5.46 8.22,4.65 11.24,1.62 20.21,1.62 D25.A D9.C 24.72,2.62 25.63,1.71 37.3,1.71 37.67,2.08 41.53,2.08 42.08,2.62 42.08,2.85 BFX4.P$3
N$9
  Top 0.305: MIDIOUT.4 54.4,92.2 53.11,90.91 42.29,90.91 R8.1
N$10
  Top 0.305: R1.1 41.12,101.62 LED2.A
N$11
  Top 0.305: R3.2 43.5,92.2 MIDIOUT.5
N$12
  Top 0.305: R2.1 44.19,94.41 LED3.A
N$13
  Top 0.305: D33.C D1.A
N$14  (via drill 0.35)
  Top 0.305: D26.A D10.C 78.44,16.12 TBAR.P$3 | TBARCV.P$1 72.91,100.74 73.72,100.74 76.58,97.89 v76.58,96.62 | v82.08,54.12 82.08,64.62 v81.08,65.62 | v76.58,93.12 78.39,91.3 78.39,69.34 78.8,68.94 79.36,68.94 80.04,69.62 v81.08,69.62
  Bottom 0.305: v82.08,54.12 82.08,48.28 82.14,48.21 82.14,46.72 81.16,45.74 81.16,28.15 82.22,27.09 84.58,27.09 85.3,27.8 85.86,27.8 86.26,27.4 86.26,26.84 85.86,26.44 85.76,26.44 D10.C | v81.08,65.62 v81.08,69.62 | v76.58,93.12 v76.58,96.62
  other vias: 76.94,17.62
N$15  (via drill 0.35)
  Top 0.305: D27.A D11.C 64.94,20.18 INA.P$3 | INACV.P$1 84.34,100.74 85.15,100.74 87.58,98.32 v87.58,96.62 | v85.58,27.12 89.41,30.95 89.41,34.42 91.8,36.8 92.36,36.8 92.62,36.55 94.82,36.55 95.85,37.58 95.85,38.06 96.47,38.68 96.95,38.68 98.08,39.81 v98.08,72.12
  Bottom 0.305: v98.08,72.12 94.01,76.19 92.42,76.19 87.58,81.04 v87.58,96.62 | INA.P$3 80.71,22.25 v85.58,27.12
N$16  (via drill 0.35)
  Top 0.305: D28.A D12.C 87.94,19.97 INB.P$3 89.87,33.91 v92.08,36.12 | v95.08,51.62 95.08,52.69 97.13,54.74 97.13,100.2 96.58,100.74 95.77,100.74 INBCV.P$1
  Bottom 0.305: v92.08,36.12 92.08,48.62 v95.08,51.62
N$17  (via drill 0.35)
  Top 0.305: D29.A D13.C 77.79,36.62 78.7,35.7 80.8,35.7 80.98,35.88 80.98,37.36 78.44,39.89 MIX.P$3 78.08,40.83 v78.08,44.12 | MIXTRANSCV.P$1 80.7,87.23 79.23,87.23 78.88,86.87 78.88,80.66 79.08,80.46 v79.08,69.62 | v79.08,66.62 79.08,50.62 v78.08,49.62
  Bottom 0.305: v79.08,69.62 v79.08,66.62 | v78.08,49.62 v78.08,44.12
N$18
  Top 0.305: D30.A D14.C 91.79,54.62 92.7,53.7 94.8,53.7 94.98,53.88 94.98,55.36 92.41,57.92 OUT_FADE.P$3 92.41,69.62 83.58,78.45 81.73,78.45 79.34,80.85 79.34,86.68 79.42,86.77 91.67,86.77 OUTCV.P$1
N$19  (via drill 0.35)
  Top 0.305: C10.1 C11.1 C12.1 C13.1 C14.1
  Bottom 0.305: C14.1 46.08,81.12
  other vias: 46.18,81.12
N$20
  Top 0.305: SV1.10 SV1.9 94.22,47.62 D33.A
OUT_FADE
  Top 0.305: OUT_FADE.P$2 80.83,68.12 61.12,68.12 54.58,74.67 54.58,79.62 52.92,81.28 B5.A4 48.14,81.28 C14.2
TBAR  (via drill 0.35)
  Top 0.305: C10.2 B5.A0 58.15,64.53 63.5,64.53 63.91,64.12 v64.58,64.12 | TBAR.P$2 75.94,12.26 73.08,15.12 v72.08,15.12 | v70.08,18.62 70.08,27.87 71.48,29.27 71.48,35.58 69.73,37.33 69.73,48.21 70.08,48.56 v70.08,63.62
  Bottom 0.305: v72.08,15.12 72.08,16.62 v70.08,18.62 | v70.08,63.62 65.08,63.62 v64.58,64.12
TRANSPA  (via drill 0.35)
  Top 0.305: D15.C D31.A | D31.A 63.22,10.62 S4.1 61.26,11.47 62.5,10.22 62.5,5.69 61.44,4.62 | D31.A 61.44,4.62 | 58.44,4.62 R6.2 | 61.44,4.62 60.52,3.71 59.36,3.71 58.44,4.62 | v17.08,75.12 17.08,77.79 20.3,81.01 20.3,86.1 17.89,88.5 17.89,90.44 18.58,91.12 21.93,91.12 23.3,92.49 30.16,92.49 40.11,82.55 52.08,82.55 53.27,83.74 TRANPORTA.P$1 61.48,81.69 62.29,81.69 62.38,81.6 62.38,74.32 v66.58,70.12 | v65.58,45.12 61.26,40.8 61.26,32.95 58.3,30 58.3,4.76 58.44,4.62 | v69.08,50.62 69.08,65.62 v68.58,66.12
  Bottom 0.305: B5.D6 5.04,70.32 5.04,72.38 7.78,75.12 v17.08,75.12 | v65.58,45.12 65.58,47.12 v69.08,50.62 | v68.58,66.12 66.58,68.12 v66.58,70.12
TRANSPB  (via drill 0.35)
  Top 0.305: v32.58,91.12 40.58,83.12 40.95,83.49 49.43,83.49 51.03,85.09 60.5,85.09 61.85,83.74 TRANSPORTB.P$1 72.91,81.69 73.72,81.69 76.58,78.84 v76.58,69.62 | v17.58,80.62 17.58,81.29 18.8,82.51 18.8,85.1 17.08,86.82 v17.08,90.62 | S3.1 84.12,11.47 85.36,10.22 85.36,5.47 D32.A D16.C 89.72,4.62 90.63,3.71 91.8,3.71 92.71,4.62 R7.2 93.68,18.73 92.98,19.43 92.98,21.72 93.58,22.32 v93.58,33.62 | v76.58,66.62 76.58,63.62 v78.08,62.12
  Bottom 0.305: v32.58,91.12 30.89,91.12 29.97,92.04 18.49,92.04 v17.08,90.62 | v17.58,80.62 15.26,78.3 12.66,78.3 12.26,77.9 12.26,77.34 13.79,75.8 17.36,75.8 17.76,75.4 17.76,74.84 17.36,74.44 11.94,74.44 6.64,69.13 6.39,69.13 B5.D7 | v76.58,69.62 v76.58,66.62 | v78.08,62.12 87.08,53.12 87.08,36.62 90.08,33.62 v93.58,33.62